# Altium project Ntimer_Project.PrjPcb
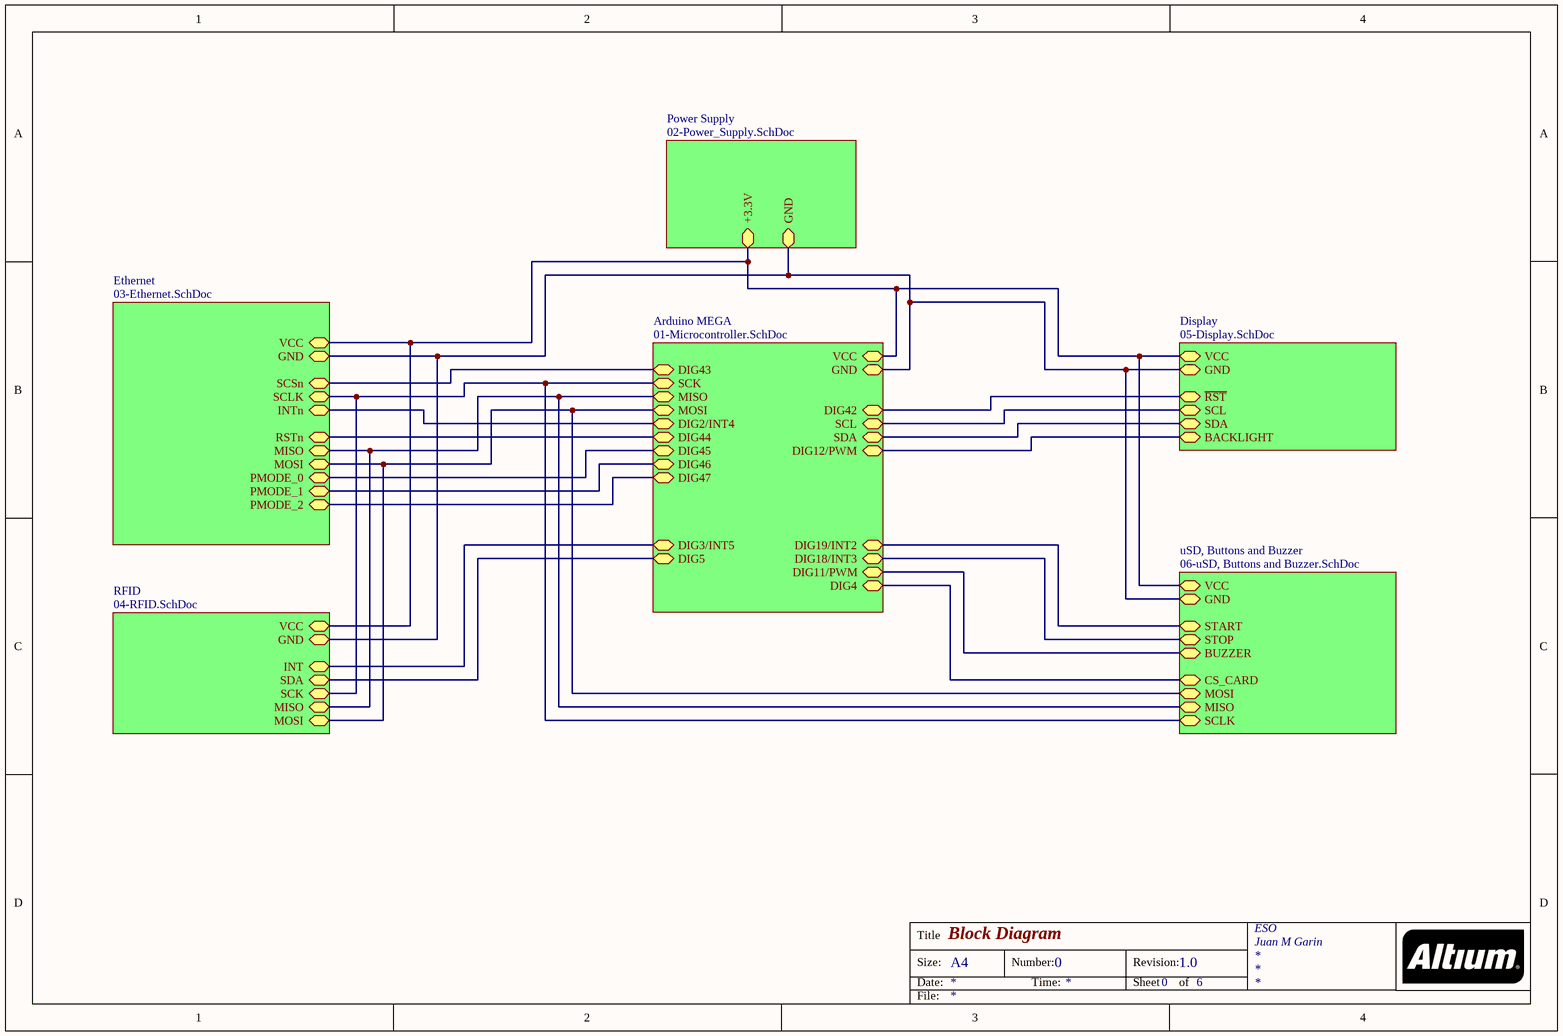
[diagram p0: 00-Block_Diagram.SchDoc]
7 sheets, 137 parts. Net scope: hierarchical (ports join the sheet entries above them; power ports are global).
Board file: Ntimer.PcbDoc
Sheets:
  00-Block_Diagram.SchDoc
    Ethernet = 03-Ethernet.SchDoc
    Power Supply = 02-Power_Supply.SchDoc
    Arduino MEGA = 01-Microcontroller.SchDoc
    uSD, Buttons and Buzzer = 06-uSD, Buttons and Buzzer.SchDoc
    RFID = 04-RFID.SchDoc
    Display = 05-Display.SchDoc

## Sheet 00-Block_Diagram.SchDoc: Block Diagram
size A4; CheckedBy: Juan M Garin; Author: Juan M Garin; CompanyName: ESO; DrawnBy: Juan M Garin; Engineer: Juan M Garin; Organization: ESO; Address1: Juan M Garin; DocumentNumber: 0; Revision: 1.0; SheetNumber: 0; SheetTotal: 6; ProjectName: Central Controller

### Sub-sheets
Arduino MEGA = 01-Microcontroller.SchDoc: GND, VCC, SCK, MISO, MOSI, DIG4, DIG43, DIG2/INT4, DIG44, DIG19/INT2, DIG18/INT3, DIG11/PWM, DIG42, SCL, SDA, DIG12/PWM, DIG3/INT5, DIG5, DIG45, DIG46, DIG47
Display = 05-Display.SchDoc: SDA, SCL, ~{RST}, GND, VCC, BACKLIGHT
Ethernet = 03-Ethernet.SchDoc: GND, SCSn, VCC, SCLK, INTn, PMODE_1, PMODE_2, RSTn, MISO, MOSI, PMODE_0
Power Supply = 02-Power_Supply.SchDoc: GND, +3.3V
RFID = 04-RFID.SchDoc: GND, VCC, INT, MISO, MOSI, SDA, SCK
uSD, Buttons and Buzzer = 06-uSD, Buttons and Buzzer.SchDoc: GND, VCC, START, STOP, BUZZER, CS_CARD, MOSI, MISO, SCLK

### Nets
+3.3V: sheet Ethernet/VCC, sheet Power Supply/+3.3V, sheet Arduino MEGA/VCC, sheet uSD, Buttons and Buzzer/VCC, sheet RFID/VCC, sheet Display/VCC
GND: sheet Ethernet/GND, sheet Power Supply/GND, sheet Arduino MEGA/GND, sheet uSD, Buttons and Buzzer/GND, sheet RFID/GND, sheet Display/GND
CS_CARD: sheet Arduino MEGA/DIG4, sheet uSD, Buttons and Buzzer/CS_CARD
DIG5: sheet Arduino MEGA/DIG5, sheet RFID/SDA
DIG11: sheet Arduino MEGA/DIG11/PWM, sheet uSD, Buttons and Buzzer/BUZZER
DIG12: sheet Arduino MEGA/DIG12/PWM, sheet Display/BACKLIGHT
DIG42: sheet Arduino MEGA/DIG42, sheet Display/~{RST}
DIG43: sheet Ethernet/SCSn, sheet Arduino MEGA/DIG43
DIG44: sheet Ethernet/RSTn, sheet Arduino MEGA/DIG44
DIG45: sheet Ethernet/PMODE_0, sheet Arduino MEGA/DIG45
DIG46: sheet Ethernet/PMODE_1, sheet Arduino MEGA/DIG46
DIG47: sheet Ethernet/PMODE_2, sheet Arduino MEGA/DIG47
INT: sheet Arduino MEGA/DIG3/INT5, sheet RFID/INT
INT2: sheet Arduino MEGA/DIG19/INT2, sheet uSD, Buttons and Buzzer/START
INT3: sheet Arduino MEGA/DIG18/INT3, sheet uSD, Buttons and Buzzer/STOP
INT4: sheet Ethernet/INTn, sheet Arduino MEGA/DIG2/INT4
MISO: sheet Ethernet/MISO, sheet Arduino MEGA/MISO, sheet uSD, Buttons and Buzzer/MISO, sheet RFID/MISO
MOSI: sheet Ethernet/MOSI, sheet Arduino MEGA/MOSI, sheet uSD, Buttons and Buzzer/MOSI, sheet RFID/MOSI
SCK: sheet Ethernet/SCLK, sheet Arduino MEGA/SCK, sheet uSD, Buttons and Buzzer/SCLK, sheet RFID/SCK
SCL: sheet Arduino MEGA/SCL, sheet Display/SCL
SDA: sheet Arduino MEGA/SDA, sheet Display/SDA

### Notes on the sheet
- Title
- Size:
- Date:
- A4
- Number:
- Time:
- Revision:
- Sheet
- of
- File:

## Sheet 03-Ethernet.SchDoc: Ethernet Connection
size A4; Engineer: Juan M Garin; Organization: ESO; Address1: Juan M Garin; DocumentNumber: 3; Revision: 1.0; SheetNumber: 3; SheetTotal: 6
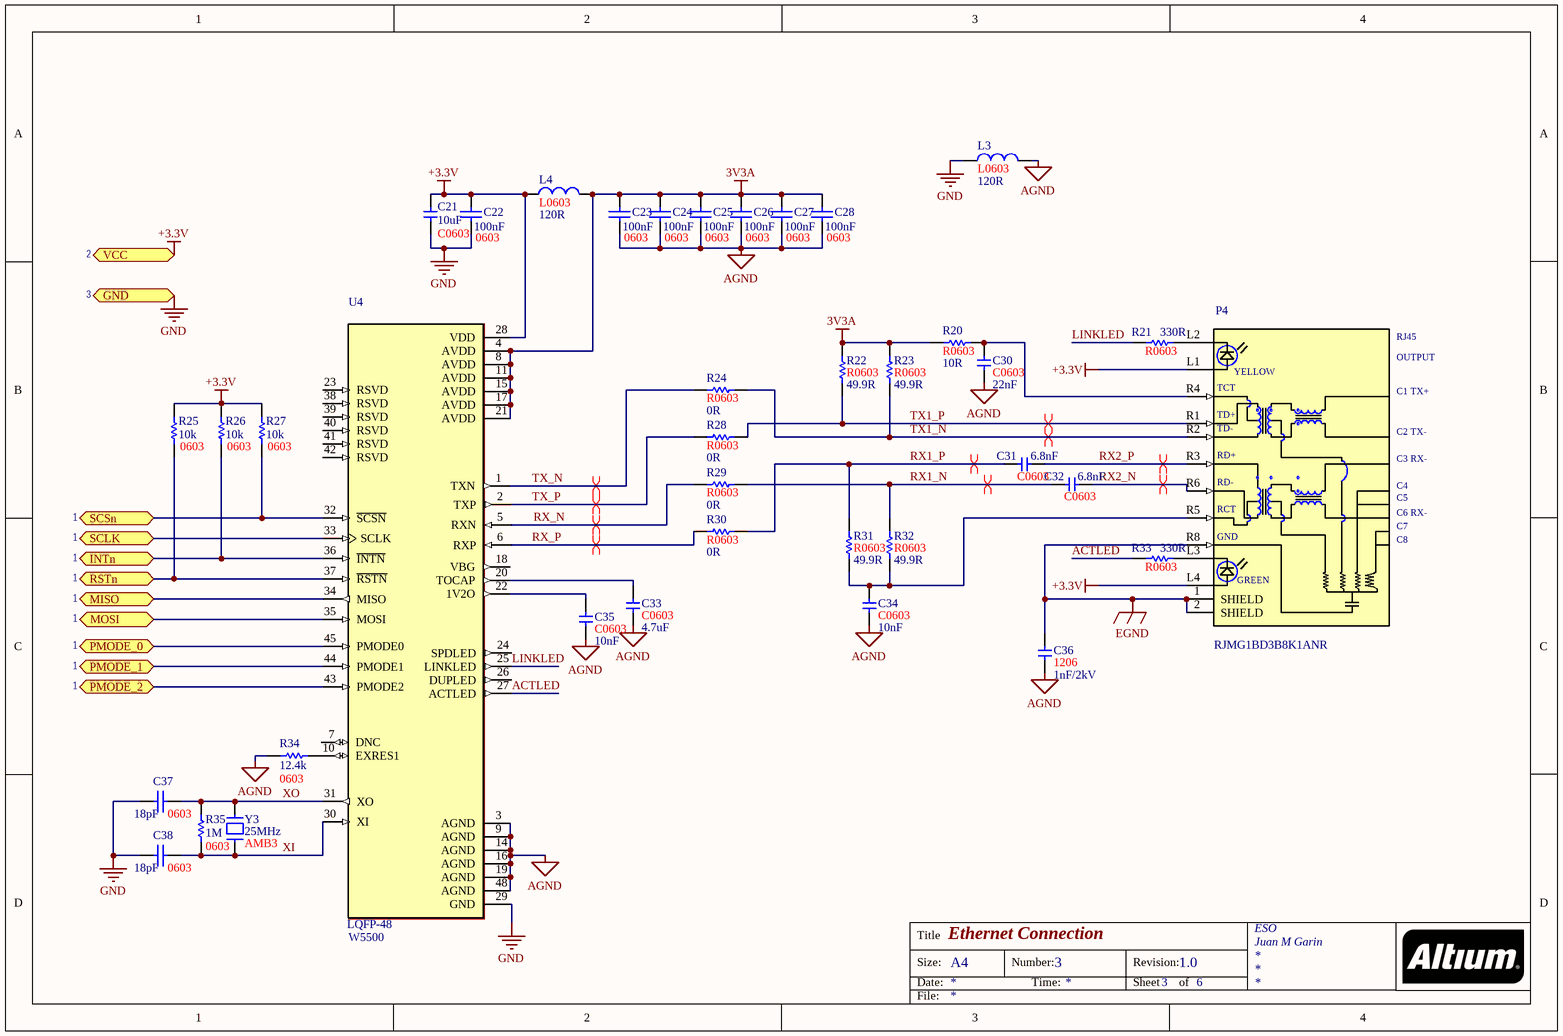
[diagram p1: 03-Ethernet.SchDoc]

### Parts
C21  10uF  [C0603]
C22  100nF  PackageReference: 0603  [C0603]
C23  100nF  PackageReference: 0603  [C0603]
C24  100nF  PackageReference: 0603  [C0603]
C25  100nF  PackageReference: 0603  [C0603]
C26  100nF  PackageReference: 0603  [C0603]
C27  100nF  PackageReference: 0603  [C0603]
C28  100nF  PackageReference: 0603  [C0603]
C30  22nF  [C0603]
C31  6.8nF  [C0603]
C32  6.8nF  [C0603]
C33  4.7uF  [C0603]
C34  10nF  [C0603]
C35  10nF  [C0603]
C36  PackageReference: 1206  [R1206]  (hidden comment: 1nF/2kV)
C37  18pF  PackageReference: 0603  [C0603]
C38  18pF  PackageReference: 0603  [C0603]
L3  120R  [L0603]
L4  120R  [L0603]
P4  RJMG1BD3B8K1ANR  [CONN_RJMG1BD3B8K1ANR_RJMG1BD3B8K1ANR(Primary)]
R20  10R  [R0603]
R21  330R  [R0603]
R22  49.9R  [R0603]
R23  49.9R  [R0603]
R24  0R  [R0603]
R25  10k  PackageReference: 0603  [R0603]
R26  10k  PackageReference: 0603  [R0603]
R27  10k  PackageReference: 0603  [R0603]
R28  0R  [R0603]
R29  0R  [R0603]
R30  0R  [R0603]
R31  49.9R  [R0603]
R32  49.9R  [R0603]
R33  330R  [R0603]
R34  12.4k  PackageReference: 0603  [R0603]
R35  1M  PackageReference: 0603  [R0603]
U4  W5500  PackageReference: LQFP-48  [QFP50P700X700X160-48N]
Y3  25MHz  PackageReference: AMB3  [CRYSTAL-AMB3_5X3.2_1.3]

### Ports
GND, INTn, MISO, MOSI, PMODE_0, PMODE_1, PMODE_2, RSTn, SCLK, SCSn, VCC

### Nets
3V3A: C23.2 C24.2 C25.2 C26.2 C27.2 C28.2 L4.2 R20.1 R22.1 R23.1 U4.4(AVDD) U4.8(AVDD) U4.11(AVDD) U4.15(AVDD) U4.17(AVDD) U4.21(AVDD)
+3.3V: C21.2 C22.2 L4.1 P4.L1 P4.L4 R25.1 R26.1 R27.1 U4.28(VDD) ; port VCC
AGND: C23.1 C24.1 C25.1 C26.1 C27.1 C28.1 C30.1 C33.1 C34.1 C35.1 C36.1 L3.2 R34.1 U4.3(AGND) U4.9(AGND) U4.14(AGND) U4.16(AGND) U4.19(AGND) U4.48(AGND)
EGND: C36.2 P4.1(SHIELD) P4.2(SHIELD) P4.R8(GND)
GND: C21.1 C22.1 C37.2 C38.2 L3.1 U4.29(GND) ; port GND
ACTLED: R33.1 U4.27(ACTLED)
DIG43: R27.2 U4.32(~{SCSN}) ; port SCSn
DIG44: R25.2 U4.37(~{RSTN}) ; port RSTn
DIG45: U4.45(PMODE0) ; port PMODE_0
DIG46: U4.44(PMODE1) ; port PMODE_1
DIG47: U4.43(PMODE2) ; port PMODE_2
INT4: R26.2 U4.36(~{INTN}) ; port INTn
LINKLED: R21.1 U4.25(LINKLED)
MISO: U4.34(MISO) ; port MISO
MOSI: U4.35(MOSI) ; port MOSI
RX1_N: C32.2 R29.2 R32.1
RX1_P: C31.2 R30.2 R31.1
RX2_N: C32.1 P4.R6(RD-)
RX2_P: C31.1 P4.R3(RD+)
RX_N: R29.1 U4.5(RXN)
RX_P: R30.1 U4.6(RXP)
SCK: U4.33(SCLK) ; port SCLK
TX1_N: P4.R2(TD-) R23.2 R24.2
TX1_P: P4.R1(TD+) R22.2 R28.2
TX_N: R24.1 U4.1(TXN)
TX_P: R28.1 U4.2(TXP)
XI: C38.1 R35.1 U4.30(XI) Y3.1
XO: C37.1 R35.2 U4.31(XO) Y3.2
NetC30_2: C30.2 P4.R4(TCT) R20.2
NetC33_2: C33.2 U4.20(TOCAP)
NetC34_2: C34.2 P4.R5(RCT) R31.2 R32.2
NetC35_2: C35.2 U4.22(1V2O)
NetP4_L2: P4.L2 R21.2
NetP4_L3: P4.L3 R33.2
NetR34_2: R34.2 U4.10(EXRES1)

Not connected (* = marked no-connect by the designer): U4 7(DNC) 18(VBG) 23(RSVD) 24(SPDLED) 26(DUPLED) 38(RSVD) 39(RSVD) 40(RSVD) 41(RSVD) 42(RSVD)

### Layout directives
differential pair: RX1_N, RX1_P, RX2_N, RX2_P, RX_N, RX_P, TX1_N, TX1_P, TX_N, TX_P

### Notes on the sheet
- 2
- 3
- 1
- Title
- Size:
- Date:
- A4
- Number:
- Time:
- Revision:
- Sheet
- of
- File:
- (in symbol RJMG1BD3B8K1ANR) RJ45; OUTPUT; YELLOW; C1 TX+; C2 TX-; C3 RX-; C4; C5; C6 RX-; C7; C8; GREEN

### Library data of the parts
C21 = Cap_0603: Capacitor; Manufacturer Part Number: JMK107ABJ106MA-T; PackageReference: C0603; Value: 10uF
C22-C28 = Cap Semi: Capacitor (Semiconductor SIM Model); Manufacturer Part Number: CL10F104ZO8NNNC; Value: 100nF
C30 = Cap_0402: Capacitor; Manufacturer Part Number: CL10B223KA8NNWC; PackageReference: C0603; Value: 22nF
C31 C32 = Cap_0402: Capacitor; Manufacturer Part Number: CL10B682KB8SFNC; PackageReference: C0603; Value: 6.8nF
C33 = Cap_0402: Capacitor; Manufacturer Part Number: CL10A475MP5LNNC; PackageReference: C0603; Value: 4.7uF
C34 C35 = Cap_0402: Capacitor; Manufacturer Part Number: VJ0603Y103KXQCW1BC; PackageReference: C0603; Value: 10nF
C36 = Cap_1206: Capacitor; Manufacturer Part Number: C1206C102KGRACAUTO; Value: 1nF/2kV
C37 C38 = Cap Semi: Capacitor (Semiconductor SIM Model); Manufacturer Part Number: VJ0603A180JXACW1BC; Value: 18pF
L3 L4 = Inductor_0603: Inductor; Manufacturer Part Number: BLM18PG121SN1D; PackageReference: L0603; Value: 120R
P4 = RJMG1BD3B8K1ANR: Accessory RJ-45 With Transformer Connector - UDE; Manufacturer Part Number: RJMG1BD3B8K1ANR; Package: RJ45 with MAGNETICS; Value: *
R20 = Res_0402: Resistor; Manufacturer Part Number: RMCF0603JT10R0; PackageReference: R0603; Value: 10R
R21 R33 = Res_0402: Resistor; Manufacturer Part Number: RMCF0603JT330R; PackageReference: R0603; Value: 330R
R22 R23 R31 R32 = Res_0402: Resistor; Manufacturer Part Number: RMCF0603FT49R9; PackageReference: R0603; Value: 49.9R
R24 R28-R30 = Res_0402: Resistor; Manufacturer Part Number: CR0603-J/-000ELF; PackageReference: R0603; Value: 0R
R25-R27 = Res1: Resistor; Manufacturer Part Number: RMCF0603FT10K0; Value: 10k
R34 = Res1: Resistor; Manufacturer Part Number: RMCF0603FT12K4; Value: 12.4k
R35 = Res1: Resistor; Manufacturer Part Number: RMCF0603FG1M00; Value: 1M
U4 = W5500: Victor Pure White Collection Wood Tidy Tower Organizer; Package: LQFP-48 Victor Technologies; Manufacturer Part Number: W5500
Y3 = CRYSTAL: Manufacturer Part Number: ABM3-25.000MHZ-D2Y-T

## Sheet 02-Power_Supply.SchDoc: Power Supply
size A4; Engineer: Juan M Garin; Organization: ESO; Address1: Juan M Garin; DocumentNumber: 2; Revision: 1.0; SheetNumber: 2; SheetTotal: 6
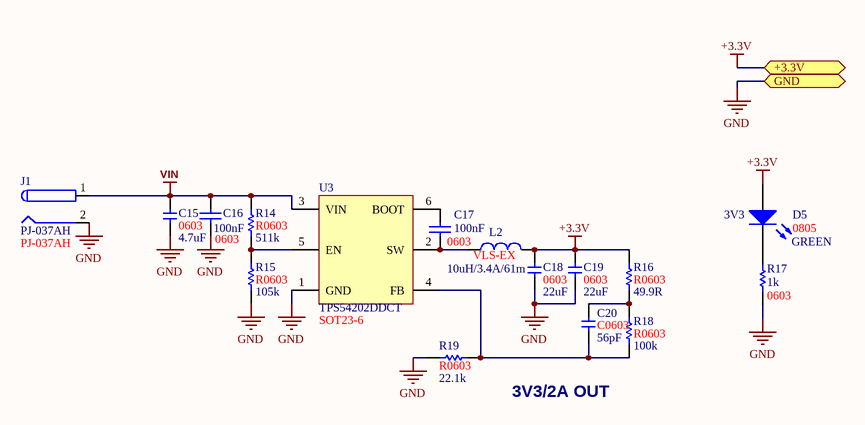
[diagram p2: 02-Power_Supply.SchDoc]

### Parts
C15  PackageReference: 0603  [C0603]  (hidden comment: 4.7uF)
C16  100nF  PackageReference: 0603  [C0603]
C17  100nF  PackageReference: 0603  [C0603]
C18  PackageReference: 0603  [C0603]  (hidden comment: 22uF)
C19  PackageReference: 0603  [C0603]  (hidden comment: 22uF)
C20  56pF  [C0603]
D5  3V3  value GREEN  PackageReference: 0805  [LED0805]
J1  PJ-037AH  [CON_PJ-037A]
L2  PackageReference: VLS-EX  [IND6045]  (hidden comment: 10uH/3.4A/61m)
R14  511k  [R0603]
R15  105k  [R0603]
R16  49.9R  [R0603]
R17  1k  PackageReference: 0603  [R0603]
R18  100k  [R0603]
R19  22.1k  [R0603]
U3  TPS54202DDCT  [SOT23-6]

### Ports
+3.3V, GND

### Nets
+3.3V: C18.2 C19.2 D5.1(A) L2.2 R16.1 ; port +3.3V
GND: C15.1 C16.1 C18.1 C19.1 J1.2 R15.2 R17.1 R19.1 U3.1(GND) ; port GND
VIN: C15.2 C16.2 J1.1 R14.1 U3.3(VIN)
NetC17_1: C17.1 L2.1 U3.2(SW)
NetC17_2: C17.2 U3.6(BOOT)
NetC20_1: C20.1 R18.2 R19.2 U3.4(FB)
NetC20_2: C20.2 R16.2 R18.1
NetD5_2: D5.2(K) R17.2
NetR14_2: R14.2 R15.1 U3.5(EN)

### Notes on the sheet
- 3V3/2A OUT
- Title
- Size:
- Date:
- A4
- Number:
- Time:
- Revision:
- Sheet
- of
- File:

### Library data of the parts
C15 = Cap_0603: Capacitor; Manufacturer Part Number: C1608X5R1C475M080AC; Value: 4.7uF
C16 C17 = Cap Semi: as C22 on sheet 03-Ethernet; Value: 100nF
C18 C19 = Cap_0603: Capacitor; Manufacturer Part Number: CL10A226MQ8NRNC; Value: 22uF
C20 = Cap_0402: Capacitor; Manufacturer Part Number: CL10C560JB8NNNC; PackageReference: C0603; Value: 56pF
D5 = LED_SMD: GREEN; Manufacturer Part Number: LTST-S220GKT
J1 = PJ-037AH: CONN PWR JACK 2X5.5MM SOLDER; Manufacturer Part Number: PJ-037AH; PackageReference: PJ-037AH
L2 = Inductor_0603: Inductor; Manufacturer Part Number: VLS6045EX-100M; Value: 10uH/3.4A/61m
R14 = Res_0402: Resistor; Manufacturer Part Number: RMCF0603FT511K; PackageReference: R0603; Value: 511k
R15 = Res_0402: Resistor; Manufacturer Part Number: RMCF0603FT105K; PackageReference: R0603; Value: 105k
R16 = Res_0402: as R22 on sheet 03-Ethernet; PackageReference: R0603; Value: 49.9R
R17 = Res1: Resistor; Manufacturer Part Number: RMCF0603FG1K00; Value: 1k
R18 = Res_0402: Resistor; Manufacturer Part Number: CR0603-JW-104ELF; PackageReference: R0603; Value: 100k
R19 = Res_0402: Resistor; Manufacturer Part Number: RNCP0603FTD22K1; PackageReference: R0603; Value: 22.1k
U3 = TPS54202DDCT: IC REG BUCK ADJ 2A SYNC SOT23-6; Manufacturer Part Number: TPS54202DDCT; PackageReference: SOT23-6

## Sheet 01-Microcontroller.SchDoc: Microcontroller
size A3; Engineer: Juan M Garin; Organization: ESO; Address1: Juan M Garin; DocumentNumber: 1; Revision: 1.0; SheetNumber: 1; SheetTotal: 6
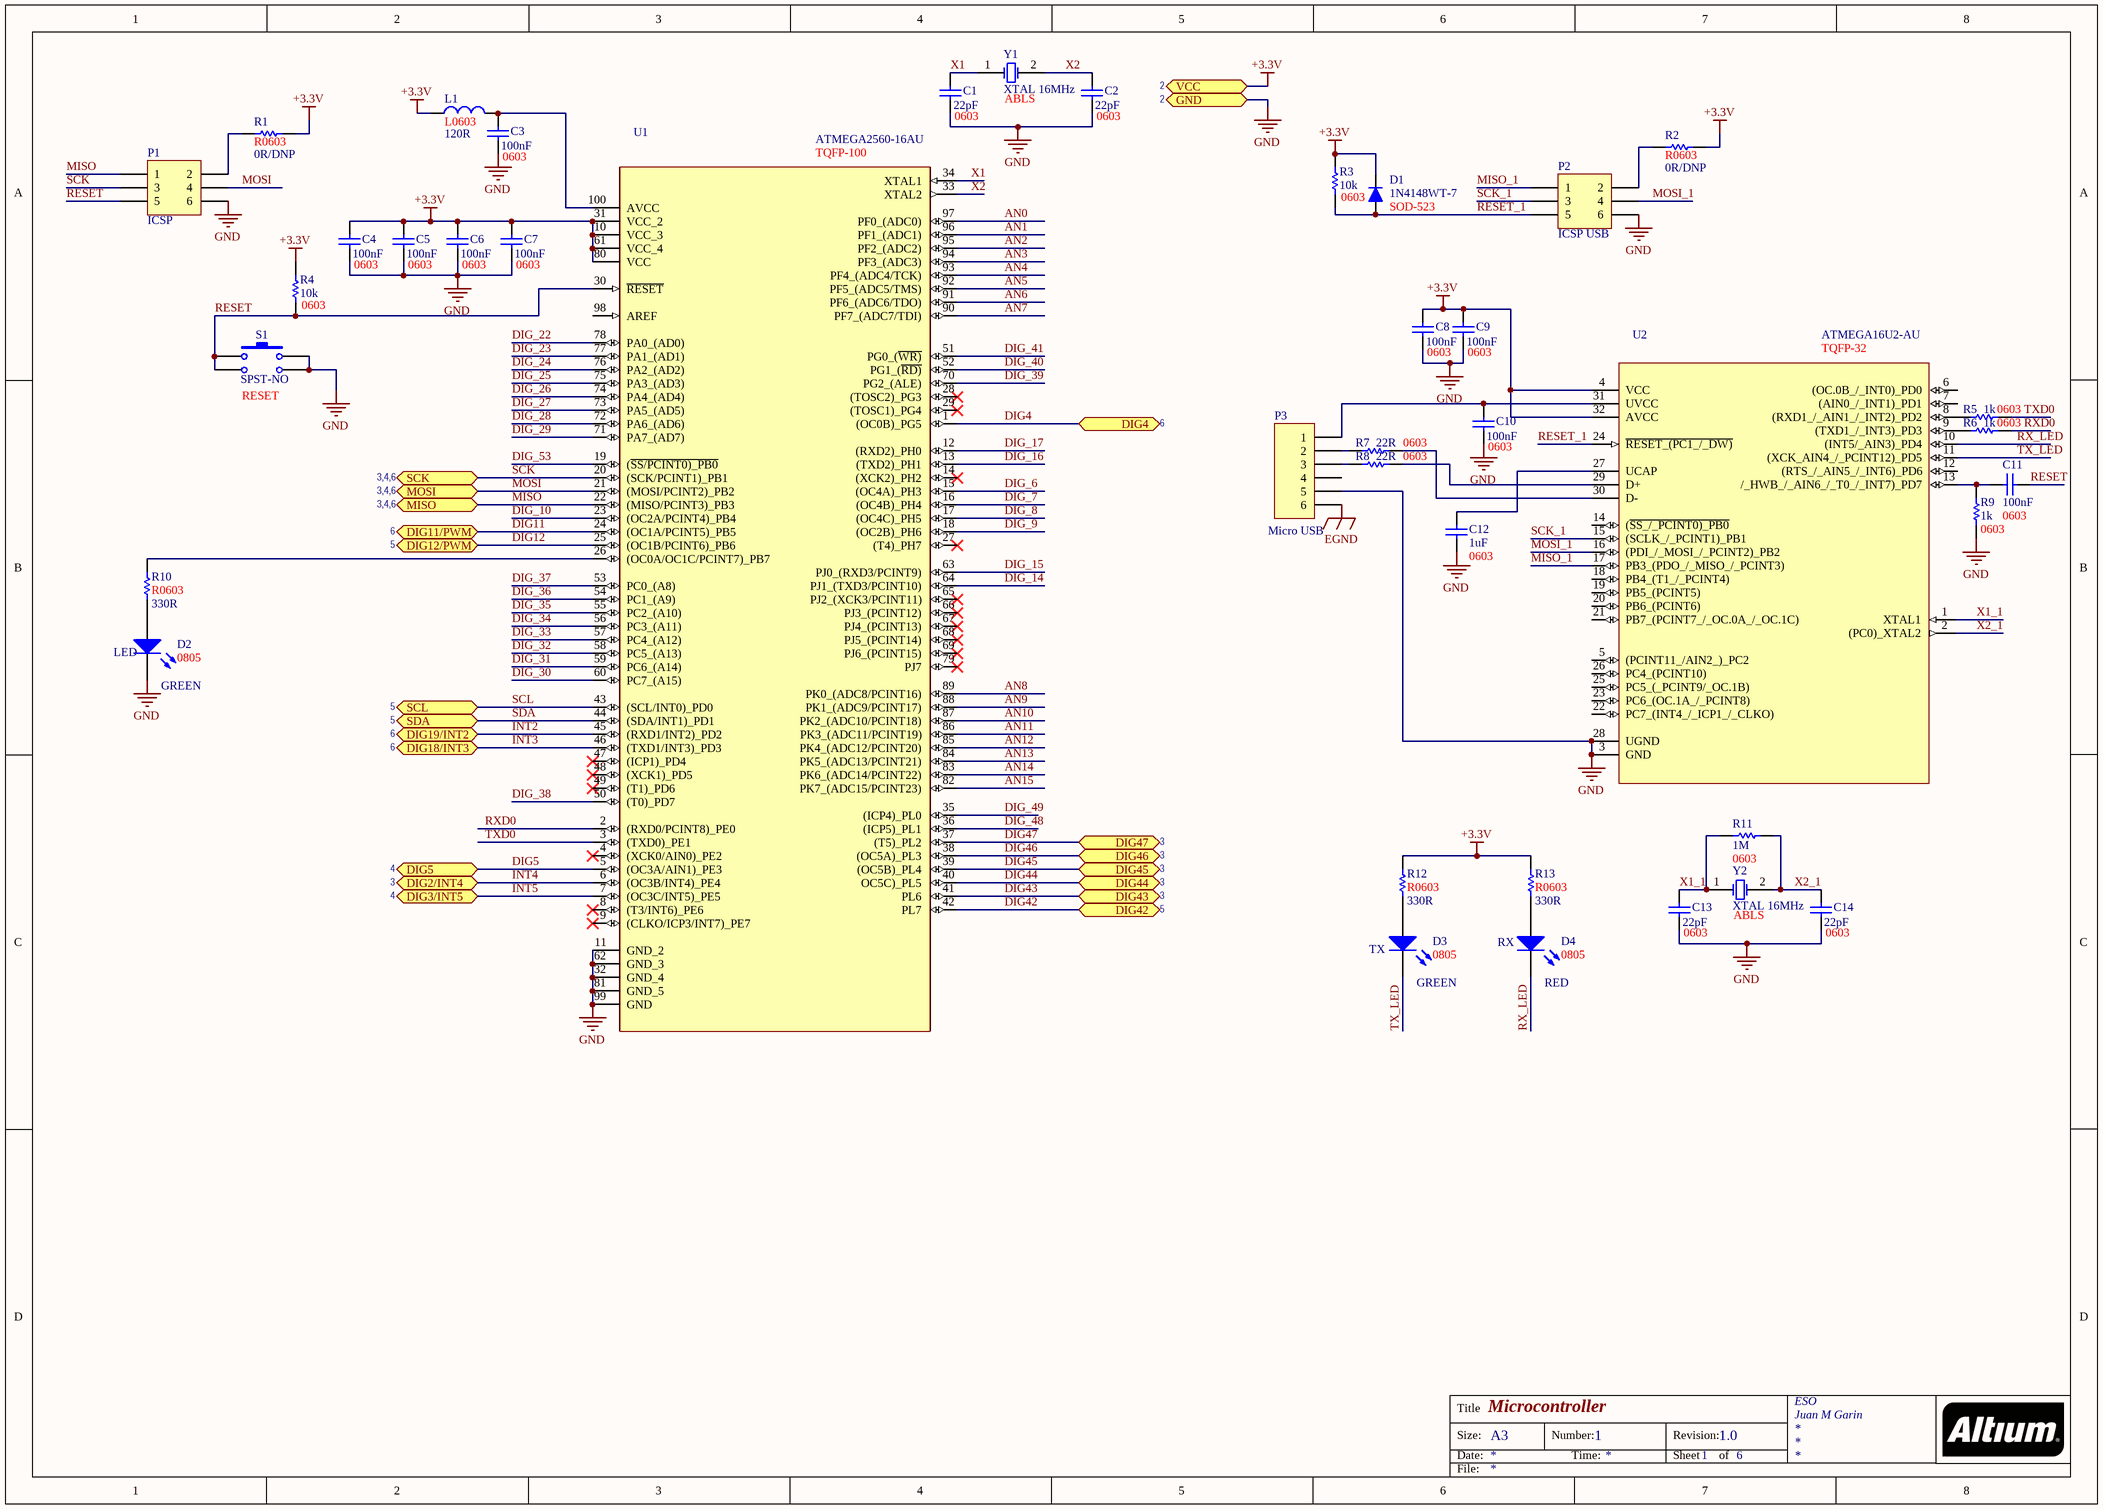
[diagram p3: 01-Microcontroller.SchDoc]

### Parts
C1  22pF  PackageReference: 0603  [C0603]
C2  22pF  PackageReference: 0603  [C0603]
C3  100nF  PackageReference: 0603  [C0603]
C4  100nF  PackageReference: 0603  [C0603]
C5  100nF  PackageReference: 0603  [C0603]
C6  100nF  PackageReference: 0603  [C0603]
C7  100nF  PackageReference: 0603  [C0603]
C8  100nF  PackageReference: 0603  [C0603]
C9  100nF  PackageReference: 0603  [C0603]
C10  100nF  PackageReference: 0603  [C0603]
C11  100nF  PackageReference: 0603  [C0603]
C12  1uF  PackageReference: 0603  [C0603]
C13  22pF  PackageReference: 0603  [C0603]
C14  22pF  PackageReference: 0603  [C0603]
D1  1N4148WT-7  PackageReference: SOD-523  [SOD523]
D2  LED  value GREEN  PackageReference: 0805  [LED0805]
D3  TX  value GREEN  PackageReference: 0805  [LED0805]
D4  RX  value RED  PackageReference: 0805  [LED0805]
L1  120R  [L0603]
P1  ICSP  [HDR2X3]
P2  ICSP USB  [HDR2X3]
P3  Micro USB  [CON_MOLEX_105133-0011]
R1  0R/DNP  [R0603]
R2  0R/DNP  [R0603]
R3  10k  PackageReference: 0603  [R0603]
R4  10k  PackageReference: 0603  [R0603]
R5  1k  PackageReference: 0603  [R0603]
R6  1k  PackageReference: 0603  [R0603]
R7  22R  PackageReference: 0603  [R0603]
R8  22R  PackageReference: 0603  [R0603]
R9  1k  PackageReference: 0603  [R0603]
R10  330R  [R0603]
R11  1M  PackageReference: 0603  [R0603]
R12  330R  [R0603]
R13  330R  [R0603]
S1  SPST-NO  Function: RESET  [DPST-4]
U1  ATMEGA2560-16AU  PackageReference: TQFP-100  [TQFP100]
U2  ATMEGA16U2-AU  Package: TQFP-32  [32A_N]
Y1  XTAL 16MHz  PackageReference: ABLS  [XTAL-SMD]
Y2  XTAL 16MHz  PackageReference: ABLS  [XTAL-SMD]

### Ports
DIG2/INT4, DIG3/INT5, DIG4, DIG5, DIG11/PWM, DIG12/PWM, DIG18/INT3, DIG19/INT2, DIG42, DIG43, DIG44, DIG45, DIG46, DIG47, GND, MISO, MOSI, SCK, SCL, SDA, VCC

### Nets
+3.3V: C4.2 C5.2 C6.2 C7.2 C8.2 C9.2 D1.2(K) L1.1 R1.2 R2.2 R3.1 R4.1 R12.2 R13.2 U1.10(VCC_3) U1.31(VCC_2) U1.61(VCC_4) U1.80(VCC) U2.4(VCC) U2.32(AVCC) ; port VCC
EGND: P3.6
GND: C1.1 C2.1 C3.1 C4.1 C5.1 C6.1 C7.1 C8.1 C9.1 C10.1 C12.2 C13.1 C14.1 D2.2(K) P1.6 P2.6 P3.5 R9.1 S1.3 S1.4 U1.11(GND_2) U1.32(GND_4) U1.62(GND_3) U1.81(GND_5) U1.99(GND) U2.3(GND) U2.28(UGND) ; port GND
AN0: U1.97(PF0_(ADC0))
AN1: U1.96(PF1_(ADC1))
AN2: U1.95(PF2_(ADC2))
AN3: U1.94(PF3_(ADC3))
AN4: U1.93(PF4_(ADC4/TCK))
AN5: U1.92(PF5_(ADC5/TMS))
AN6: U1.91(PF6_(ADC6/TDO))
AN7: U1.90(PF7_(ADC7/TDI))
AN8: U1.89(PK0_(ADC8/PCINT16))
AN9: U1.88(PK1_(ADC9/PCINT17))
AN10: U1.87(PK2_(ADC10/PCINT18))
AN11: U1.86(PK3_(ADC11/PCINT19))
AN12: U1.85(PK4_(ADC12/PCINT20))
AN13: U1.84(PK5_(ADC13/PCINT21))
AN14: U1.83(PK6_(ADC14/PCINT22))
AN15: U1.82(PK7_(ADC15/PCINT23))
DIG4: U1.1((OC0B)_PG5) ; port DIG4  [project net CS_CARD]
DIG5: U1.5((OC3A/AIN1)_PE3) ; port DIG5
DIG11: U1.24((OC1A/PCINT5)_PB5) ; port DIG11/PWM
DIG12: U1.25((OC1B/PCINT6)_PB6) ; port DIG12/PWM
DIG42: U1.42(PL7) ; port DIG42
DIG43: U1.41(PL6) ; port DIG43
DIG44: U1.40(OC5C)_PL5) ; port DIG44
DIG45: U1.39((OC5B)_PL4) ; port DIG45
DIG46: U1.38((OC5A)_PL3) ; port DIG46
DIG47: U1.37((T5)_PL2) ; port DIG47
DIG_6: U1.15((OC4A)_PH3)
DIG_7: U1.16((OC4B)_PH4)
DIG_8: U1.17((OC4C)_PH5)
DIG_9: U1.18((OC2B)_PH6)
DIG_10: U1.23((OC2A/PCINT4)_PB4)
DIG_14: U1.64(PJ1_(TXD3/PCINT10))
DIG_15: U1.63(PJ0_(RXD3/PCINT9))
DIG_16: U1.13((TXD2)_PH1)
DIG_17: U1.12((RXD2)_PH0)
DIG_22: U1.78(PA0_(AD0))
DIG_23: U1.77(PA1_(AD1))
DIG_24: U1.76(PA2_(AD2))
DIG_25: U1.75(PA3_(AD3))
DIG_26: U1.74(PA4_(AD4))
DIG_27: U1.73(PA5_(AD5))
DIG_28: U1.72(PA6_(AD6))
DIG_29: U1.71(PA7_(AD7))
DIG_30: U1.60(PC7_(A15))
DIG_31: U1.59(PC6_(A14))
DIG_32: U1.58(PC5_(A13))
DIG_33: U1.57(PC4_(A12))
DIG_34: U1.56(PC3_(A11))
DIG_35: U1.55(PC2_(A10))
DIG_36: U1.54(PC1_(A9))
DIG_37: U1.53(PC0_(A8))
DIG_38: U1.50((T0)_PD7)
DIG_39: U1.70(PG2_(ALE))
DIG_40: U1.52(PG1_(~{RD)})
DIG_41: U1.51(PG0_(~{WR)})
DIG_48: U1.36((ICP5)_PL1)
DIG_49: U1.35((ICP4)_PL0)
DIG_53: U1.19((~{SS/PCINT0)_PB0})
INT2: U1.45((RXD1/INT2)_PD2) ; port DIG19/INT2
INT3: U1.46((TXD1/INT3)_PD3) ; port DIG18/INT3
INT4: U1.6((OC3B/INT4)_PE4) ; port DIG2/INT4
INT5: U1.7((OC3C/INT5)_PE5) ; port DIG3/INT5  [project net INT]
MISO: P1.1 U1.22((MISO/PCINT3)_PB3) ; port MISO
MISO_1: P2.1 U2.17(PB3_(PDO_/_MISO_/_PCINT3))
MOSI: P1.4 U1.21((MOSI/PCINT2)_PB2) ; port MOSI
MOSI_1: P2.4 U2.16((PDI_/_MOSI_/_PCINT2)_PB2)
RESET: C11.1 P1.5 R4.2 S1.1 S1.2 U1.30(~{RESET})
RESET_1: D1.1(A) P2.5 R3.2 U2.24(~{RESET_(PC1_/_DW)})
RX_LED: D4.2(K) U2.10((INT5/_AIN3)_PD4)
RXD0: R6.2 U1.2((RXD0/PCINT8)_PE0)
SCK: P1.3 U1.20((SCK/PCINT1)_PB1) ; port SCK
SCK_1: P2.3 U2.15((SCLK_/_PCINT1)_PB1)
SCL: U1.43((SCL/INT0)_PD0) ; port SCL
SDA: U1.44((SDA/INT1)_PD1) ; port SDA
TX_LED: D3.2(K) U2.11((XCK_AIN4_/_PCINT12)_PD5)
TXD0: R5.2 U1.3((TXD0)_PE1)
X1: C1.2 U1.34(XTAL1) Y1.1(OSC1)
X1_1: C13.2 R11.2 U2.1(XTAL1) Y2.1(OSC1)
X2: C2.2 U1.33(XTAL2) Y1.2(OSC2)
X2_1: C14.2 R11.1 U2.2((PC0)_XTAL2) Y2.2(OSC2)
NetC3_2: C3.2 L1.2 U1.100(AVCC)
NetC10_2: C10.2 P3.1 U2.31(UVCC)
NetC11_2: C11.2 R9.2 U2.13(/_HWB_/_AIN6_/_T0_/_INT7)_PD7)
NetC12_1: C12.1 U2.27(UCAP)
NetD2_1: D2.1(A) R10.1
NetD3_1: D3.1(A) R12.1
NetD4_1: D4.1(A) R13.1
NetP1_2: P1.2 R1.1
NetP2_2: P2.2 R2.1
NetP3_2: P3.2 R7.2
NetP3_3: P3.3 R8.2
NetR5_1: R5.1 U2.8((RXD1_/_AIN1_/_INT2)_PD2)
NetR6_1: R6.1 U2.9((TXD1_/_INT3)_PD3)
NetR7_1: R7.1 U2.30(D-)
NetR8_1: R8.1 U2.29(D+)
NetR10_2: R10.2 U1.26((OC0A/OC1C/PCINT7)_PB7)

Not connected (* = marked no-connect by the designer): P3 4; U1 4((XCK0/AIN0)_PE2)* 8((T3/INT6)_PE6)* 9((CLKO/ICP3/INT7)_PE7)* 14((XCK2)_PH2)* 27((T4)_PH7)* 28((TOSC2)_PG3)* 29((TOSC1)_PG4)* 47((ICP1)_PD4)* 48((XCK1)_PD5)* 49((T1)_PD6)* 65(PJ2_(XCK3/PCINT11))* 66(PJ3_(PCINT12))* 67(PJ4_(PCINT13))* 68(PJ5_(PCINT14))* 69(PJ6_(PCINT15))* 79(PJ7)* 98(AREF); U2 5((PCINT11_/AIN2_)_PC2) 6((OC.0B_/_INT0)_PD0) 7((AIN0_/_INT1)_PD1) 12((RTS_/_AIN5_/_INT6)_PD6) 14((~{SS_/_PCINT0)_PB0}) 18(PB4_(T1_/_PCINT4)) 19(PB5_(PCINT5)) 20(PB6_(PCINT6)) 21(PB7_(PCINT7_/_OC.0A_/_OC.1C)) 22(PC7_(INT4_/_ICP1_/_CLKO)) 23(PC6_(OC.1A_/_PCINT8)) 25(PC5_(_PCINT9/_OC.1B)) 26(PC4_(PCINT10))

### Notes on the sheet
- 2
- 6
- 3,4,6
- 5
- 3
- 4
- Title
- Size:
- Date:
- A3
- Number:
- Time:
- Revision:
- Sheet
- of
- File:

### Library data of the parts
C1 C2 C13 C14 = Cap Semi: Capacitor (Semiconductor SIM Model); Manufacturer Part Number: 885012006004; Value: 22pF
C3-C11 = Cap Semi: as C22 on sheet 03-Ethernet; Value: 100nF
C12 = Cap Semi: Capacitor (Semiconductor SIM Model); Manufacturer Part Number: CL10A105KQ8NNNC; Value: 1uF
D1 = DIODE: Manufacturer Part Number: 1N4148WT-7
D2 D3 = LED_SMD: as D5 on sheet 02-Power_Supply
D4 = LED_SMD: YLW; Manufacturer Part Number: LTST-C171KRKT
L1 = Inductor_0603: as L3 on sheet 03-Ethernet; PackageReference: L0603; Value: 120R
P1 P2 = Header 3X2: Header, 3-Pin, Dual row; Manufacturer Part Number: 5-146254-3
P3 = Header 6: CONN MICRO USB B 2.0 VERT SMT; Manufacturer Part Number: 1051330011
R1 R2 = Res_0402: as R24 on sheet 03-Ethernet; PackageReference: R0603; Value: 0R/DNP
R3 R4 = Res1: as R25 on sheet 03-Ethernet; Value: 10k
R5 R6 R9 = Res1: as R17 on sheet 02-Power_Supply; Value: 1k
R7 R8 = Res1: Resistor; Manufacturer Part Number: CRGCQ0603J22R; Value: 22R
R10 R12 R13 = Res_0402: as R21 on sheet 03-Ethernet; PackageReference: R0603; Value: 330R
R11 = Res1: as R35 on sheet 03-Ethernet; Value: 1M
S1 = SW-PB: Switch; Manufacturer Part Number: PTS645SM43SMTR92 LFS; PackageReference: SPST-NO
U1 = ATMEGA2560-16AU: Embedded microcontroller ATMEGA2560-16AU TQFP 100 _14x14_ Microchip Technology 8-Bit 16 MHz I/O number 86; Manufacturer Part Number: ATMEGA2560-16AU
U2 = ATMEGA16U2-AU: MCU 8-bit ATmega AVR RISC 16KB Flash 3.3V/5V 32-Pin TQFP; Manufacturer Part Number: ATMEGA16U2-AU
Y1 Y2 = XTAL 16MHz: Crystal Oscillator 16MHz SMD; Manufacturer Part Number: ABLS-16.000MHZ-B2-T; Value: XTAL 16MHz

## Sheet 06-uSD, Buttons and Buzzer.SchDoc: uSD, Buttons and Buzzer
size A4; Engineer: Juan M Garin; Organization: ESO; Address1: Juan M Garin; DocumentNumber: 6; Revision: 1.0; SheetNumber: 6; SheetTotal: 6
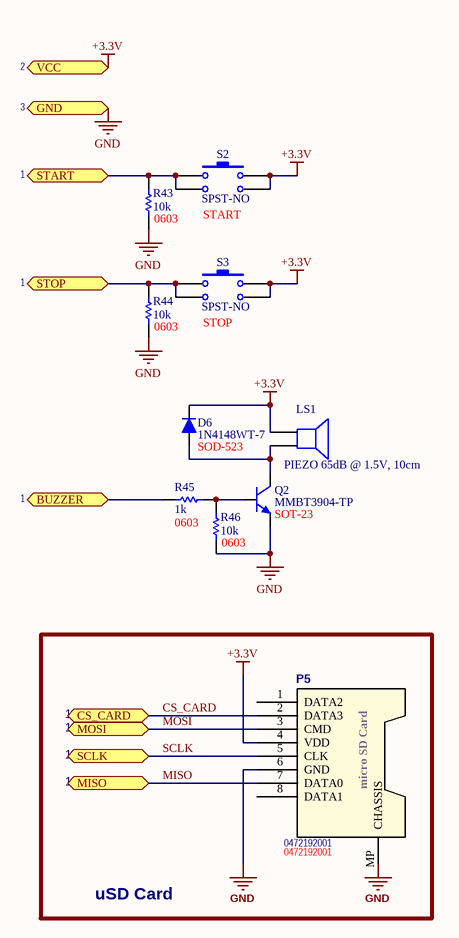
[diagram p4: 06-uSD, Buttons and Buzzer.SchDoc]

### Parts
D6  1N4148WT-7  PackageReference: SOD-523  [SOD523]
LS1  PIEZO 65dB @ 1.5V, 10cm  [PIEZO_XDCR_PKMCS0909E4000-R1]
P5  0472192001  [MICROSD_MOLEX_0472192001]
Q2  MMBT3904-TP  PackageReference: SOT-23  [SOT23-3]
R43  10k  PackageReference: 0603  [R0603]
R44  10k  PackageReference: 0603  [R0603]
R45  1k  PackageReference: 0603  [R0603]
R46  10k  PackageReference: 0603  [R0603]
S2  SPST-NO  Function: START  [BUTTON_D6R90_GREEN]
S3  SPST-NO  Function: STOP  [BUTTON_D6R90_RED]

### Blocks framed on the sheet
uSD Card: P5

### Ports
BUZZER, CS_CARD, GND, MISO, MOSI, SCLK, START, STOP, VCC

### Nets
+3.3V: D6.2(K) LS1.1 P5.4(VDD) S2.3 S2.4 S3.3 S3.4 ; port VCC
GND: P5.6(GND) P5.MP(CHASSIS) Q2.1(E) R43.2 R44.2 R46.2 ; port GND
CS_CARD: P5.2(DATA3) ; port CS_CARD
DIG11: R45.1 ; port BUZZER
INT2: R43.1 S2.1 S2.2 ; port START
INT3: R44.1 S3.1 S3.2 ; port STOP
MISO: P5.7(DATA0) ; port MISO
MOSI: P5.3(CMD) ; port MOSI
SCLK: P5.5(CLK) ; port SCLK  [project net SCK]
NetD6_1: D6.1(A) LS1.2 Q2.3(C)
NetQ2_2: Q2.2(B) R45.2 R46.1

Not connected (* = marked no-connect by the designer): P5 1(DATA2) 8(DATA1)

### Notes on the sheet
- 2
- 3
- 1
- Title
- Size:
- Date:
- A4
- Number:
- Time:
- Revision:
- Sheet
- of
- File:
- (in symbol microSD-114-00841-68) micro SD Card

### Library data of the parts
D6 = DIODE: Manufacturer Part Number: 1N4148WT-7
LS1 = Speaker: Loudspeaker; Manufacturer Part Number: PKMCS0909E4000-R1
P5 = microSD-114-00841-68: Micro SD Card Slot 8-pin Push-In Push-Out; Manufacturer Part Number: 0472192001; PackageReference: 0472192001
Q2 = MMBT3904: TRANS NPN 40V 0.2A SOT-23; Manufacturer Part Number: MMBT3904-TP
R43 R44 R46 = Res1: as R25 on sheet 03-Ethernet; Value: 10k
R45 = Res1: as R17 on sheet 02-Power_Supply; Value: 1k
S2 = SW-PB: Switch; Manufacturer Part Number: D6R50 F1 LFS; PackageReference: SPST-NO
S3 = SW-PB: Switch; Manufacturer Part Number: D6R40 F1 LFS; PackageReference: SPST-NO

## Sheet 04-RFID.SchDoc: RFID
size A4; Engineer: Juan M Garin; Organization: ESO; Address1: Juan M Garin; DocumentNumber: 4; Revision: 1.0; SheetNumber: 4; SheetTotal: 6
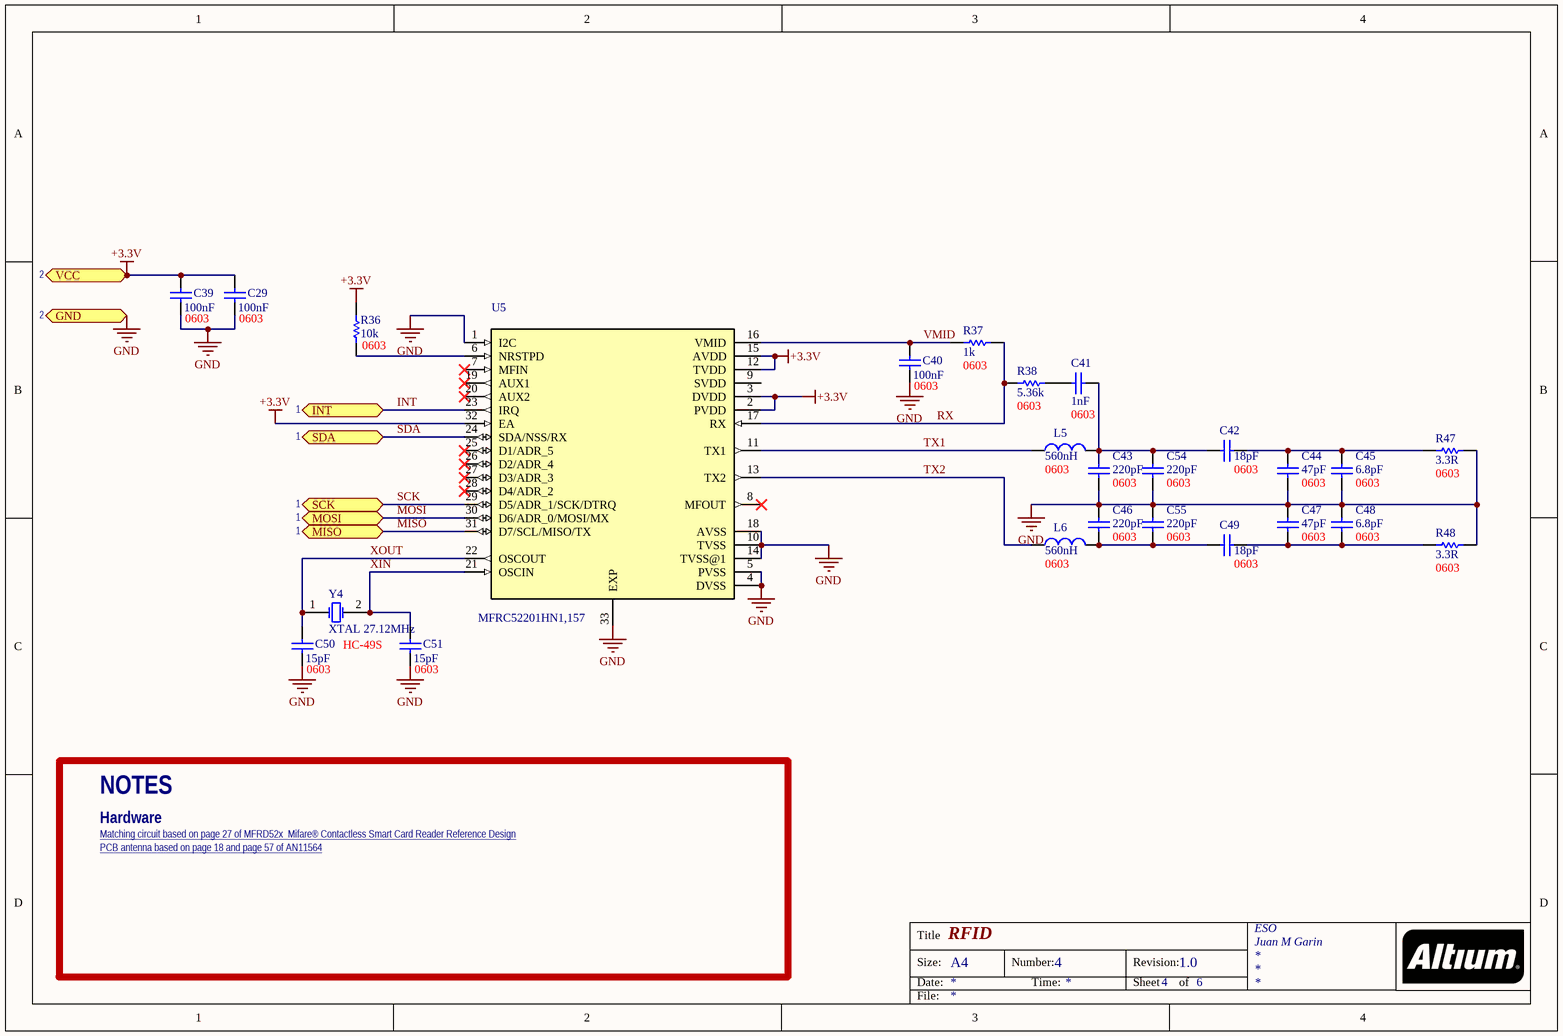
[diagram p5: 04-RFID.SchDoc]

### Parts
C29  100nF  PackageReference: 0603  [C0603]
C39  100nF  PackageReference: 0603  [C0603]
C40  100nF  PackageReference: 0603  [C0603]
C41  1nF  PackageReference: 0603  [C0603]
C42  18pF  PackageReference: 0603  [C0603]
C43  220pF  PackageReference: 0603  [C0603]
C44  47pF  PackageReference: 0603  [C0603]
C45  6.8pF  PackageReference: 0603  [C0603]
C46  220pF  PackageReference: 0603  [C0603]
C47  47pF  PackageReference: 0603  [C0603]
C48  6.8pF  PackageReference: 0603  [C0603]
C49  18pF  PackageReference: 0603  [C0603]
C50  15pF  PackageReference: 0603  [C0603]
C51  15pF  PackageReference: 0603  [C0603]
C54  220pF  PackageReference: 0603  [C0603]
C55  220pF  PackageReference: 0603  [C0603]
L5  PackageReference: 0603  [L0603]  (hidden comment: 560nH)
L6  PackageReference: 0603  [L0603]  (hidden comment: 560nH)
R36  10k  PackageReference: 0603  [R0603]
R37  1k  PackageReference: 0603  [R0603]
R38  5.36k  PackageReference: 0603  [R0603]
R47  3.3R  PackageReference: 0603  [R0603]
R48  3.3R  PackageReference: 0603  [R0603]
U5  MFRC52201HN1,157  [QFN-32_5x5_0.5]
Y4  XTAL 27.12MHz  PackageReference: HC-49S  [XTAL-SMD]

### Ports
GND, INT, MISO, MOSI, SCK, SDA, VCC

### Nets
+3.3V: C29.2 C39.2 R36.1 U5.2(PVDD) U5.3(DVDD) U5.12(TVDD) U5.15(AVDD) U5.32(EA) ; port VCC
GND: C29.1 C39.1 C40.1 C43.2 C44.2 C45.2 C46.1 C47.1 C48.1 C50.1 C51.1 C54.2 C55.1 R47.2 R48.2 U5.1(I2C) U5.4(DVSS) U5.5(PVSS) U5.10(TVSS) U5.14(TVSS@1) U5.18(AVSS) U5.33(EXP) ; port GND
INT: U5.23(IRQ) ; port INT
MISO: U5.31(D7/SCL/MISO/TX) ; port MISO
MOSI: U5.30(D6/ADR_0/MOSI/MX) ; port MOSI
RX: R37.2 R38.1 U5.17(RX)
SCK: U5.29(D5/ADR_1/SCK/DTRQ) ; port SCK
SDA: U5.24(SDA/NSS/RX) ; port SDA  [project net DIG5]
TX1: L5.1 U5.11(TX1)
TX2: L6.1 U5.13(TX2)
VMID: C40.2 R37.1 U5.16(VMID)
XIN: C51.2 U5.21(OSCIN) Y4.2(OSC2)
XOUT: C50.2 U5.22(OSCOUT) Y4.1(OSC1)
NetC41_1: C41.1 C42.2 C43.1 C54.1 L5.2
NetC41_2: C41.2 R38.2
NetC42_1: C42.1 C44.1 C45.1 R47.1
NetC46_2: C46.2 C49.2 C55.2 L6.2
NetC47_2: C47.2 C48.2 C49.1 R48.1
NetR36_2: R36.2 U5.6(NRSTPD)

Not connected (* = marked no-connect by the designer): U5 7(MFIN)* 8(MFOUT)* 9(SVDD) 19(AUX1)* 20(AUX2)* 25(D1/ADR_5)* 26(D2/ADR_4)* 27(D3/ADR_3)* 28(D4/ADR_2)*

### Notes on the sheet
- 2
- 1
- NOTES
- Matching circuit based on page 27 of MFRD52x  Mifare® Contactless Smart Card Reader Reference Design
- Hardware
- PCB antenna based on page 18 and page 57 of AN11564
- Title
- Size:
- Date:
- A4
- Number:
- Time:
- Revision:
- Sheet
- of
- File:

### Library data of the parts
C29 C39 C40 = Cap Semi: as C22 on sheet 03-Ethernet; Value: 100nF
C41 = Cap Semi: Capacitor (Semiconductor SIM Model); Manufacturer Part Number: CL10B102JB8NNNC; Value: 1nF
C42 C49 = Cap Semi: as C37 on sheet 03-Ethernet; Value: 18pF
C43 C46 C54 C55 = Cap Semi: Capacitor (Semiconductor SIM Model); Manufacturer Part Number: 885012206030; Value: 220pF
C44 C47 = Cap Semi: Capacitor (Semiconductor SIM Model); Manufacturer Part Number: 885012006021; Value: 47pF
C45 C48 = Cap Semi: Capacitor (Semiconductor SIM Model); Manufacturer Part Number: CL10C6R8DB8NNNC; Value: 6.8pF
C50 C51 = Cap Semi: Capacitor (Semiconductor SIM Model); Manufacturer Part Number: CL10C150JC8NNNC; Value: 15pF
L5 L6 = Inductor_0603: Inductor; Manufacturer Part Number: AIML-0603-R56K-T; Value: 560nH
R36 = Res1: as R25 on sheet 03-Ethernet; Value: 10k
R37 = Res1: as R17 on sheet 02-Power_Supply; Value: 1k
R38 = Res1: Resistor; Manufacturer Part Number: CR0603-FX-5361ELF; Value: 5.36k
R47 R48 = Res1: Resistor; Manufacturer Part Number: CRGCQ0603J3R3; Value: 3.3R
U5 = MFRC52201HN1,157: MFRC52201 Series 2.5 V - 3.6 V 27.12 MHz IC Smart Card Reader - HVQFN-32; MF: NXP Semiconductors; Package: HVQFN-32 NXP Semiconductors; Manufacturer Part Number: MFRC52201HN1,157
Y4 = XTAL 16MHz: Crystal Oscillator 27.12MHz SMD; Manufacturer Part Number: 9C-27.120MAAJ-T; Value: XTAL 27.12MHz

## Sheet 05-Display.SchDoc: Display
size A4; Engineer: Juan M Garin; Organization: ESO; Address1: Juan M Garin; DocumentNumber: 5; Revision: 1.0; SheetNumber: 5; SheetTotal: 6
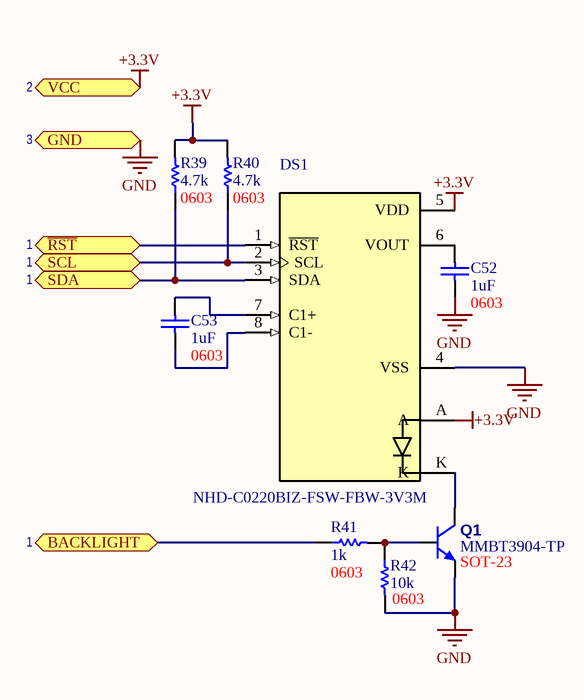
[diagram p6: 05-Display.SchDoc]

### Parts
C52  1uF  PackageReference: 0603  [C0603]
C53  1uF  PackageReference: 0603  [C0603]
DS1  NHD-C0220BIZ-FSW-FBW-3V3M  [NHD-C0220BIZ-FSW-FBW-3V3M]
Q1  MMBT3904-TP  PackageReference: SOT-23  [SOT23-3]
R39  4.7k  PackageReference: 0603  [R0603]
R40  4.7k  PackageReference: 0603  [R0603]
R41  1k  PackageReference: 0603  [R0603]
R42  10k  PackageReference: 0603  [R0603]

### Ports
BACKLIGHT, GND, SCL, SDA, VCC, ~{RST}

### Nets
+3.3V: DS1.5(VDD) DS1.A R39.2 R40.2 ; port VCC
GND: C52.2 DS1.4(VSS) Q1.1(E) R42.2 ; port GND
DIG12: R41.1 ; port BACKLIGHT
DIG42: DS1.1(~{RST}) ; port ~{RST}
SCL: DS1.2(SCL) R40.1 ; port SCL
SDA: DS1.3(SDA) R39.1 ; port SDA
NetC52_1: C52.1 DS1.6(VOUT)
NetC53_1: C53.1 DS1.7(C1+)
NetC53_2: C53.2 DS1.8(C1-)
NetDS1_K: DS1.K Q1.3(C)
NetQ1_2: Q1.2(B) R41.2 R42.1

### Notes on the sheet
- 2
- 3
- 1
- Title
- Size:
- Date:
- A4
- Number:
- Time:
- Revision:
- Sheet
- of
- File:

### Library data of the parts
C52 C53 = Cap Semi: as C12 on sheet 01-Microcontroller; Value: 1uF
DS1 = NHD-C0220BIZ-FSW-FBW-3V3M: n LCD COG CHAR 2X20 WH TRANSFL; Manufacturer Part Number: NHD-C0220BIZ-FSW-FBW-3V3M; Decription: LCD COG CHAR 2X20 WH TRANSFL
Q1 = MMBT3904: TRANS NPN 40V 0.2A SOT-23; Manufacturer Part Number: MMBT3904-TP
R39 R40 = Res1: Resistor; Manufacturer Part Number: RMCF0603JT4K70; Value: 4.7k
R41 = Res1: as R17 on sheet 02-Power_Supply; Value: 1k
R42 = Res1: as R25 on sheet 03-Ethernet; Value: 10k

## Nets that join several sheets
+3.3V: 03-Ethernet (9 pins), 02-Power_Supply (5 pins), 01-Microcontroller (20 pins), 06-uSD, Buttons and Buzzer (7 pins), 04-RFID (8 pins), 05-Display (DS1.5 DS1.A R39.2 R40.2)
EGND: 03-Ethernet (C36.2 P4.1 P4.2 P4.R8), 01-Microcontroller (P3.6)
GND: 03-Ethernet (6 pins), 02-Power_Supply (9 pins), 01-Microcontroller (27 pins), 06-uSD, Buttons and Buzzer (6 pins), 04-RFID (22 pins), 05-Display (C52.2 DS1.4 Q1.1 R42.2)
CS_CARD: 01-Microcontroller (U1.1), 06-uSD, Buttons and Buzzer (P5.2)
DIG5: 01-Microcontroller (U1.5), 04-RFID (U5.24)
DIG11: 01-Microcontroller (U1.24), 06-uSD, Buttons and Buzzer (R45.1)
DIG12: 01-Microcontroller (U1.25), 05-Display (R41.1)
DIG42: 01-Microcontroller (U1.42), 05-Display (DS1.1)
DIG43: 03-Ethernet (R27.2 U4.32), 01-Microcontroller (U1.41)
DIG44: 03-Ethernet (R25.2 U4.37), 01-Microcontroller (U1.40)
DIG45: 03-Ethernet (U4.45), 01-Microcontroller (U1.39)
DIG46: 03-Ethernet (U4.44), 01-Microcontroller (U1.38)
DIG47: 03-Ethernet (U4.43), 01-Microcontroller (U1.37)
INT: 01-Microcontroller (U1.7), 04-RFID (U5.23)
INT2: 01-Microcontroller (U1.45), 06-uSD, Buttons and Buzzer (R43.1 S2.1 S2.2)
INT3: 01-Microcontroller (U1.46), 06-uSD, Buttons and Buzzer (R44.1 S3.1 S3.2)
INT4: 03-Ethernet (R26.2 U4.36), 01-Microcontroller (U1.6)
MISO: 03-Ethernet (U4.34), 01-Microcontroller (P1.1 U1.22), 06-uSD, Buttons and Buzzer (P5.7), 04-RFID (U5.31)
MOSI: 03-Ethernet (U4.35), 01-Microcontroller (P1.4 U1.21), 06-uSD, Buttons and Buzzer (P5.3), 04-RFID (U5.30)
SCK: 03-Ethernet (U4.33), 01-Microcontroller (P1.3 U1.20), 06-uSD, Buttons and Buzzer (P5.5), 04-RFID (U5.29)
SCL: 01-Microcontroller (U1.43), 05-Display (DS1.2 R40.1)
SDA: 01-Microcontroller (U1.44), 05-Display (DS1.3 R39.1)